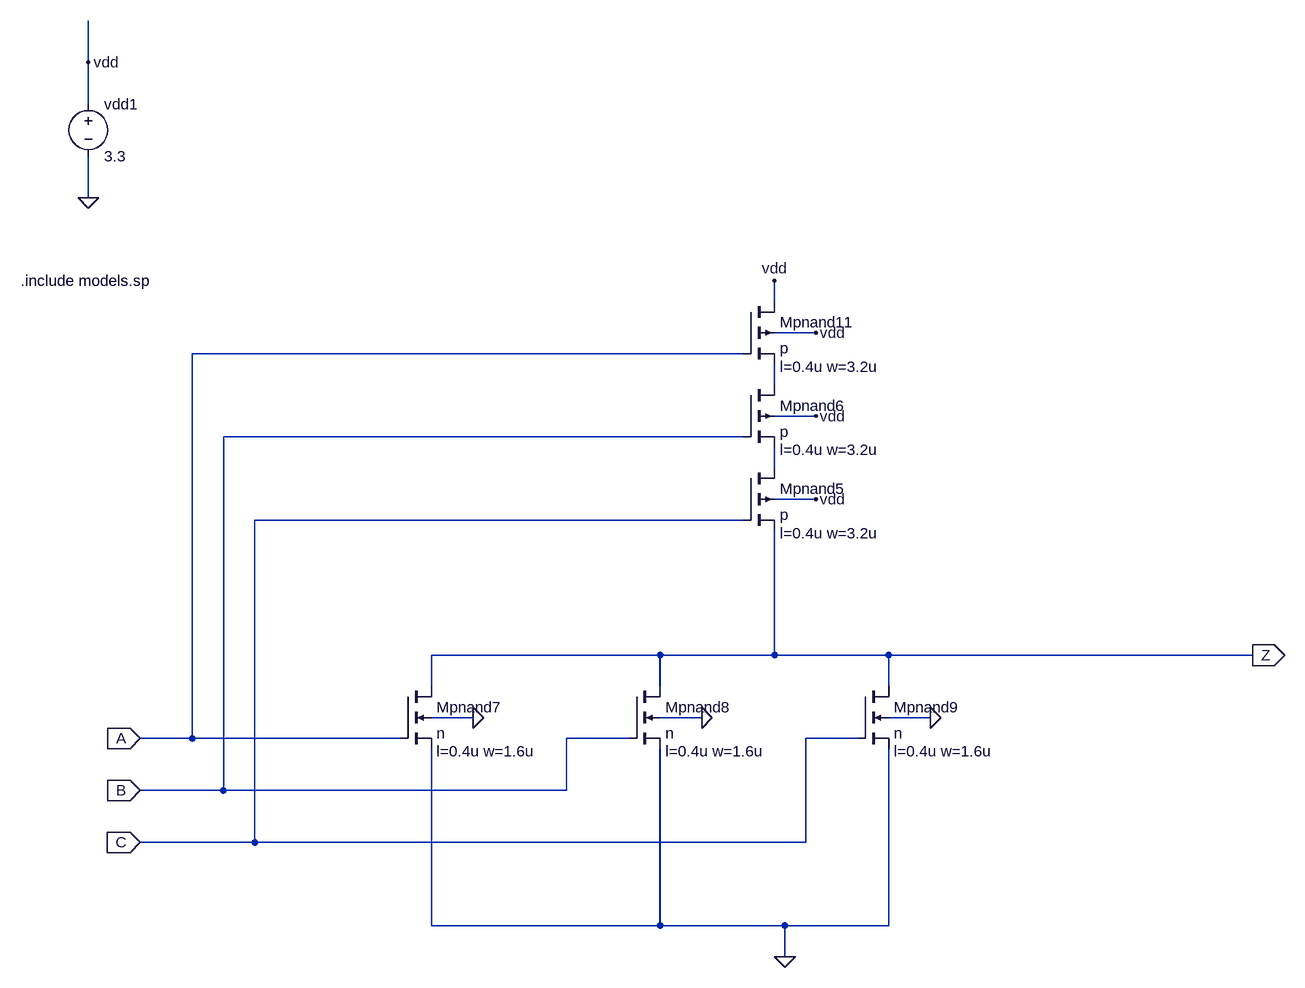
[diagram p0: schematic nor3.asc]
nor3.asc, the LTspice schematic file:
Version 4
SHEET 1 1032 1124
WIRE -832 -272 -832 -336
WIRE -832 -208 -832 -272
WIRE -832 -64 -832 -128
WIRE 224 96 224 64
WIRE 288 144 224 144
WIRE 176 176 -672 176
WIRE 224 224 224 192
WIRE 288 272 224 272
WIRE 176 304 -624 304
WIRE 224 352 224 320
WIRE 288 400 224 400
WIRE 176 432 -576 432
WIRE 48 640 -304 640
WIRE 224 640 224 448
WIRE 224 640 48 640
WIRE 400 640 224 640
WIRE 960 640 400 640
WIRE -304 688 -304 640
WIRE 48 688 48 640
WIRE 400 688 400 640
WIRE -240 736 -304 736
WIRE 112 736 48 736
WIRE 464 736 400 736
WIRE -672 768 -672 176
WIRE -672 768 -752 768
WIRE -352 768 -672 768
WIRE 0 768 -96 768
WIRE 352 768 272 768
WIRE -624 848 -624 304
WIRE -624 848 -752 848
WIRE -96 848 -96 768
WIRE -96 848 -624 848
WIRE -576 928 -576 432
WIRE -576 928 -752 928
WIRE 272 928 272 768
WIRE 272 928 -576 928
WIRE -304 1056 -304 784
WIRE 48 1056 48 784
WIRE 48 1056 -304 1056
WIRE 240 1056 48 1056
WIRE 400 1056 400 784
WIRE 400 1056 240 1056
WIRE 240 1104 240 1056
FLAG -752 768 A
IOPIN -752 768 In
FLAG -752 848 B
IOPIN -752 848 In
FLAG -752 928 C
IOPIN -752 928 In
FLAG 960 640 Z
IOPIN 960 640 Out
FLAG -832 -64 0
FLAG -832 -272 vdd
FLAG -240 736 0
FLAG 112 736 0
FLAG 464 736 0
FLAG 288 400 vdd
FLAG 288 272 vdd
FLAG 288 144 vdd
FLAG 224 64 vdd
FLAG 240 1104 0
SYMBOL voltage -832 -224 R0
WINDOW 123 0 0 Left 0
WINDOW 39 0 0 Left 0
SYMATTR InstName vdd1
SYMATTR Value 3.3
SYMBOL nmos4 -352 688 R0
WINDOW 123 56 100 Left 2
SYMATTR Value2 l=0.4u w=1.6u
SYMATTR InstName Mpnand7
SYMATTR Value n
SYMBOL nmos4 0 688 R0
WINDOW 123 56 100 Left 2
SYMATTR Value2 l=0.4u w=1.6u
SYMATTR InstName Mpnand8
SYMATTR Value n
SYMBOL nmos4 352 688 R0
WINDOW 123 56 100 Left 2
SYMATTR Value2 l=0.4u w=1.6u
SYMATTR InstName Mpnand9
SYMATTR Value n
SYMBOL pmos4 176 352 R0
WINDOW 123 56 100 Left 2
SYMATTR Value2 l=0.4u w=3.2u
SYMATTR InstName Mpnand5
SYMATTR Value p
SYMBOL pmos4 176 224 R0
WINDOW 123 56 100 Left 2
SYMATTR Value2 l=0.4u w=3.2u
SYMATTR InstName Mpnand6
SYMATTR Value p
SYMBOL pmos4 176 96 R0
WINDOW 123 56 100 Left 2
SYMATTR Value2 l=0.4u w=3.2u
SYMATTR InstName Mpnand11
SYMATTR Value p
TEXT -936 64 Left 2 !.include models.sp

The netlist it stands for:
* nor3.asc
vdd1 vdd 0 3.3
Mpnand7 Z A 0 0 n l=0.4u w=1.6u
Mpnand8 Z B 0 0 n l=0.4u w=1.6u
Mpnand9 Z C 0 0 n l=0.4u w=1.6u
Mpnand5 N002 C Z vdd p l=0.4u w=3.2u
Mpnand6 N001 B N002 vdd p l=0.4u w=3.2u
Mpnand11 vdd A N001 vdd p l=0.4u w=3.2u
.model NMOS NMOS
.model PMOS PMOS
.lib standard.mos
.include models.sp
.backanno
.end